# Altium schematic sheet RGB_LEDs.SchDoc
size A
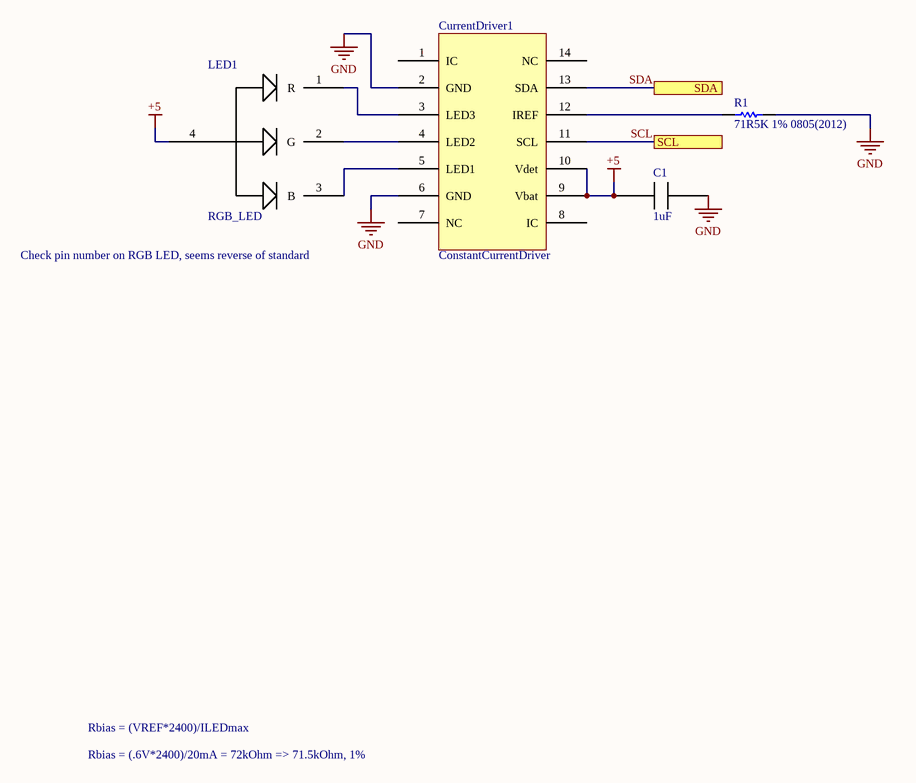
[diagram p0: RGB_LEDs.SchDoc]

## Parts
C1  1uF  [0805]
CurrentDriver1  ConstantCurrentDriver  [NCP5623]
LED1  RGB_LED  [ASMB-MTB1-0A3A2]
R1  71R5K 1% 0805(2012)  [RESC0805(2012)_N]

## Ports
SCL, SDA

## Nets
+5: C1.1 CurrentDriver1.9(Vbat) CurrentDriver1.10(Vdet) LED1.4
GND: C1.2 CurrentDriver1.2(GND) CurrentDriver1.6(GND) R1.2
SCL: CurrentDriver1.11(SCL) ; port SCL
SDA: CurrentDriver1.13(SDA) ; port SDA
NetCurrentDriver1_3: CurrentDriver1.3(LED3) LED1.1(R)
NetCurrentDriver1_4: CurrentDriver1.4(LED2) LED1.2(G)
NetCurrentDriver1_5: CurrentDriver1.5(LED1) LED1.3(B)
NetCurrentDriver1_12: CurrentDriver1.12(IREF) R1.1

Not connected (* = marked no-connect by the designer): CurrentDriver1 1(IC) 7(NC) 8(IC) 14(NC)

## Notes on the sheet
- Check pin number on RGB LED, seems reverse of standard
- Rbias = (VREF*2400)/ILEDmax
- Rbias = (.6V*2400)/20mA = 72kOhm => 71.5kOhm, 1%

## Library data of the parts
C1 = Cap
R1 = 120R 5% 0805: 120R 0.125W 5% 0805 (2012 Metric)  SMD; Case-Metric: 2012; Value: 120.00 Ohm; Case-EIA: 0805; Tolerance: 5 %; Technology: SMT; Power: 0.125 W